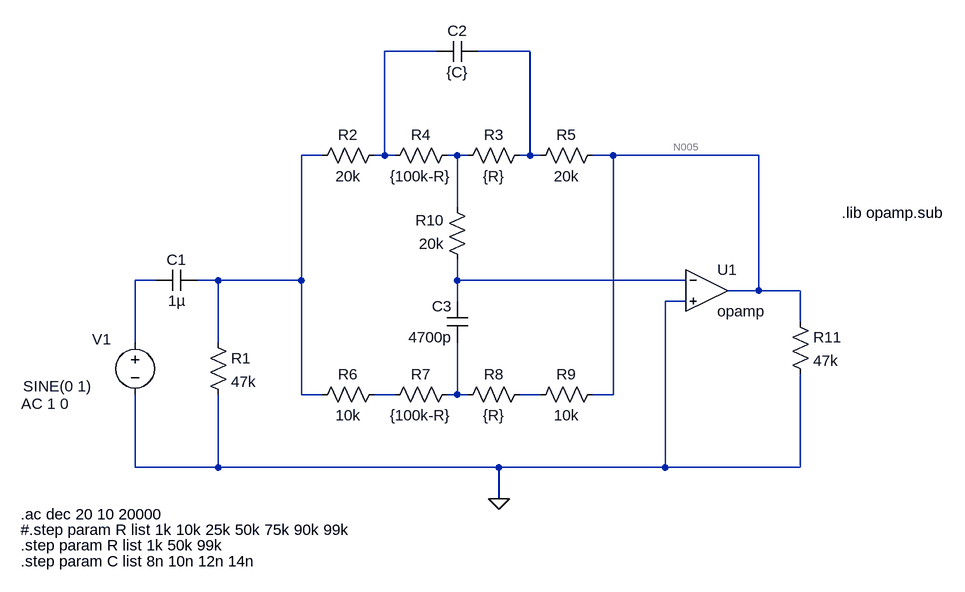
[diagram p0: schematic Modified Baxandall.asc]
Modified Baxandall.asc, the LTspice schematic file:
Version 4
SHEET 1 1116 680
WIRE 320 -128 240 -128
WIRE 464 -128 384 -128
WIRE 144 32 112 32
WIRE 240 32 240 -128
WIRE 240 32 224 32
WIRE 256 32 240 32
WIRE 352 32 336 32
WIRE 368 32 352 32
WIRE 464 32 464 -128
WIRE 464 32 448 32
WIRE 480 32 464 32
WIRE 592 32 560 32
WIRE 816 32 592 32
WIRE 352 112 352 32
WIRE -112 224 -144 224
WIRE -16 224 -48 224
WIRE 112 224 112 32
WIRE 112 224 -16 224
WIRE 352 224 352 192
WIRE 704 224 352 224
WIRE 816 240 816 32
WIRE 816 240 768 240
WIRE 880 240 816 240
WIRE 352 256 352 224
WIRE 704 256 672 256
WIRE 880 288 880 240
WIRE -144 320 -144 224
WIRE -16 320 -16 224
WIRE 112 400 112 224
WIRE 144 400 112 400
WIRE 256 400 224 400
WIRE 352 400 352 320
WIRE 352 400 336 400
WIRE 368 400 352 400
WIRE 480 400 448 400
WIRE 592 400 592 32
WIRE 592 400 560 400
WIRE -144 512 -144 400
WIRE -16 512 -16 400
WIRE -16 512 -144 512
WIRE 416 512 -16 512
WIRE 672 512 672 256
WIRE 672 512 416 512
WIRE 880 512 880 368
WIRE 880 512 672 512
WIRE 416 560 416 512
FLAG 416 560 0
SYMBOL cap -48 208 R90
WINDOW 0 0 32 VBottom 2
WINDOW 3 32 32 VTop 2
SYMATTR InstName C1
SYMATTR Value 1µ
SYMBOL cap 384 -144 R90
WINDOW 0 0 32 VBottom 2
WINDOW 3 32 32 VTop 2
SYMATTR InstName C2
SYMATTR Value {C}
SYMBOL cap 368 320 R180
WINDOW 0 24 56 Left 2
WINDOW 3 24 8 Left 2
SYMATTR InstName C3
SYMATTR Value 4700p
SYMBOL res -32 304 R0
SYMATTR InstName R1
SYMATTR Value 47k
SYMBOL res 240 16 R90
WINDOW 0 0 56 VBottom 2
WINDOW 3 32 56 VTop 2
SYMATTR InstName R2
SYMATTR Value 20k
SYMBOL res 464 16 R90
WINDOW 0 0 56 VBottom 2
WINDOW 3 32 56 VTop 2
SYMATTR InstName R3
SYMATTR Value {R}
SYMBOL res 352 16 R90
WINDOW 0 0 56 VBottom 2
WINDOW 3 32 56 VTop 2
SYMATTR InstName R4
SYMATTR Value {100k-R}
SYMBOL res 576 16 R90
WINDOW 0 0 56 VBottom 2
WINDOW 3 32 56 VTop 2
SYMATTR InstName R5
SYMATTR Value 20k
SYMBOL res 240 384 R90
WINDOW 0 0 56 VBottom 2
WINDOW 3 32 56 VTop 2
SYMATTR InstName R6
SYMATTR Value 10k
SYMBOL res 352 384 R90
WINDOW 0 0 56 VBottom 2
WINDOW 3 32 56 VTop 2
SYMATTR InstName R7
SYMATTR Value {100k-R}
SYMBOL res 464 384 R90
WINDOW 0 0 56 VBottom 2
WINDOW 3 32 56 VTop 2
SYMATTR InstName R8
SYMATTR Value {R}
SYMBOL res 576 384 R90
WINDOW 0 0 56 VBottom 2
WINDOW 3 32 56 VTop 2
SYMATTR InstName R9
SYMATTR Value 10k
SYMBOL res 368 208 R180
WINDOW 0 36 76 Left 2
WINDOW 3 36 40 Left 2
SYMATTR InstName R10
SYMATTR Value 20k
SYMBOL res 864 272 R0
SYMATTR InstName R11
SYMATTR Value 47k
SYMBOL voltage -144 304 R0
WINDOW 0 -66 11 Left 2
WINDOW 3 -172 83 Left 2
WINDOW 123 -175 110 Left 2
WINDOW 39 0 0 Left 0
SYMATTR InstName V1
SYMATTR Value SINE(0 1)
SYMATTR Value2 AC 1 0
SYMBOL Opamps\\opamp 736 176 R0
SYMATTR InstName U1
TEXT -320 584 Left 2 !.ac dec 20 10 20000
TEXT 944 120 Left 2 !.lib opamp.sub
TEXT -320 608 Left 2 !#.step param R list 1k 10k 25k 50k 75k 90k 99k
TEXT -320 632 Left 2 !.step param R list 1k 50k 99k
TEXT -320 656 Left 2 !.step param C list 8n 10n 12n 14n

The netlist it stands for:
* Modified Baxandall.asc
C1 N003 N006 1µ
C2 N002 N001 {C}
C3 N009 N007 4700p
R1 N003 0 47k
R2 N001 N003 20k
R3 N002 N004 {R}
R4 N004 N001 {100k-R}
R5 N005 N002 20k
R6 N008 N003 10k
R7 N009 N008 {100k-R}
R8 N010 N009 {R}
R9 N005 N010 10k
R10 N007 N004 20k
R11 N005 0 47k
V1 N006 0 SINE(0 1) AC 1 0
XU1 N007 0 N005 opamp Aol=100K GBW=10Meg  ; pins invin noninvin out
.ac dec 20 10 20000
.lib opamp.sub
#.step param R list 1k 10k 25k 50k 75k 90k 99k
.step param R list 1k 50k 99k
.step param C list 8n 10n 12n 14n
.backanno
.end

* Results of the author's LTspice run, read from the files saved beside the schematic
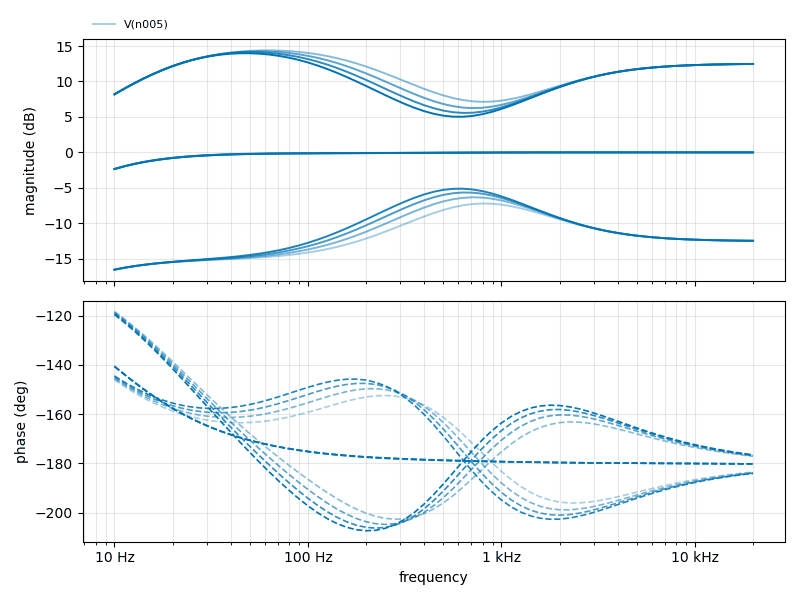
[diagram p1: AC Analysis of Modified Baxandall.asc, plotted from the saved traces]
* AC Analysis, 12 runs:
*   V(n005) [r=1000 c=8e-009]: -16.54 dB at 10 Hz, -12.47 dB at 20 kHz, peak -7.21 dB at 794.3 Hz, 3 dB below the peak at 309.1 Hz and 2.524 kHz
*   V(n005) [r=50000 c=8e-009]: -2.32 dB at 10 Hz, -0.00 dB at 20 kHz, peak -0.00 dB at 20 kHz
*   V(n005) [r=99000 c=8e-009]: 8.17 dB at 10 Hz, 12.47 dB at 20 kHz, peak 14.39 dB at 63.1 Hz, 3 dB below the peak at 16.96 Hz and 237.6 Hz
*   V(n005) [r=1000 c=1e-008]: -16.54 dB at 10 Hz, -12.47 dB at 20 kHz, peak -6.33 dB at 707.9 Hz, 3 dB below the peak at 289.3 Hz and 2.008 kHz
*   V(n005) [r=50000 c=1e-008]: -2.33 dB at 10 Hz, -0.00 dB at 20 kHz, peak -0.00 dB at 20 kHz
*   V(n005) [r=99000 c=1e-008]: 8.18 dB at 10 Hz, 12.47 dB at 20 kHz, peak 14.25 dB at 56.23 Hz, 3 dB below the peak at 16.47 Hz and 195.4 Hz
*   V(n005) [r=1000 c=1.2e-008]: -16.55 dB at 10 Hz, -12.47 dB at 20 kHz, peak -5.66 dB at 631 Hz, 3 dB below the peak at 270.3 Hz and 1.73 kHz
*   V(n005) [r=50000 c=1.2e-008]: -2.35 dB at 10 Hz, -0.00 dB at 20 kHz, peak -0.00 dB at 19.95 kHz